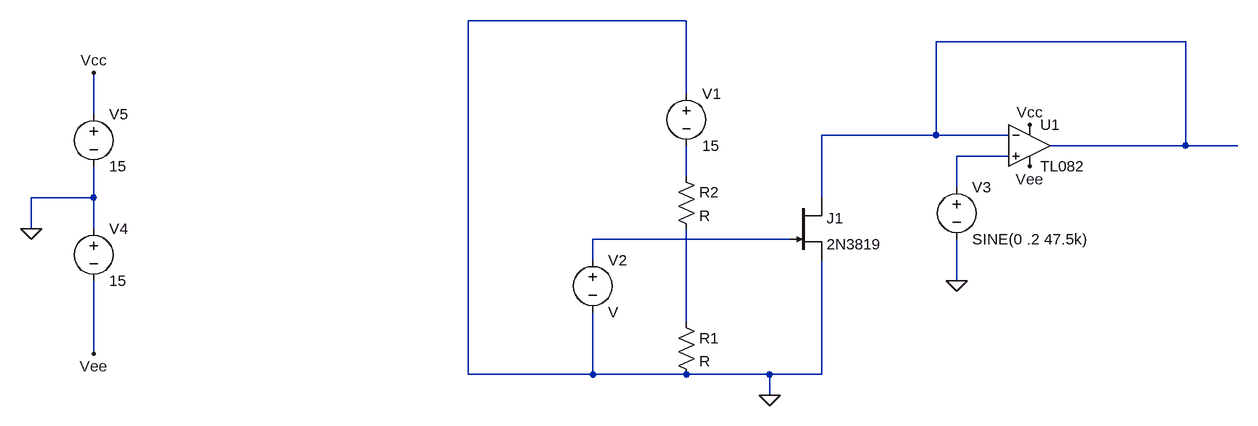
[diagram p0: schematic Modulateur.asc]
Modulateur.asc, the LTspice schematic file:
Version 4.1
SHEET 1 880 680
WIRE -32 -144 -368 -144
WIRE 736 -112 352 -112
WIRE -32 -32 -32 -144
WIRE -944 0 -944 -64
WIRE 352 32 352 -112
WIRE 352 32 176 32
WIRE 464 32 352 32
WIRE 736 48 736 -112
WIRE 736 48 528 48
WIRE 816 48 736 48
WIRE 464 64 384 64
WIRE -32 96 -32 48
WIRE 384 112 384 64
WIRE -944 128 -944 80
WIRE -944 128 -1040 128
WIRE 176 128 176 32
WIRE -1040 176 -1040 128
WIRE -944 176 -944 128
WIRE 128 192 -176 192
WIRE -176 224 -176 192
WIRE 384 256 384 192
WIRE -32 320 -32 176
WIRE -944 368 -944 256
WIRE -368 400 -368 -144
WIRE -176 400 -176 304
WIRE -176 400 -368 400
WIRE -32 400 -176 400
WIRE 96 400 -32 400
WIRE 176 400 176 224
WIRE 176 400 96 400
WIRE 96 432 96 400
FLAG 96 432 0
FLAG 384 256 0
FLAG -1040 176 0
FLAG -944 -64 Vcc
FLAG 496 16 Vcc
FLAG -944 368 Vee
FLAG 496 80 Vee
SYMBOL njf 128 128 R0
SYMATTR InstName J1
SYMATTR Value 2N3819
SYMBOL voltage -32 -48 R0
SYMATTR InstName V1
SYMATTR Value 15
SYMBOL res -48 304 R0
SYMATTR InstName R1
SYMBOL res -48 80 R0
SYMATTR InstName R2
SYMBOL voltage -176 208 R0
SYMATTR InstName V2
SYMBOL OpAmps\\opamp2 496 -16 R0
SYMATTR InstName U1
SYMATTR Value TL082
SYMBOL voltage 384 96 R0
WINDOW 123 0 0 Left 0
WINDOW 39 0 0 Left 0
SYMATTR InstName V3
SYMATTR Value SINE(0 .2 47.5k)
SYMBOL voltage -944 160 R0
WINDOW 123 0 0 Left 0
WINDOW 39 0 0 Left 0
SYMATTR InstName V4
SYMATTR Value 15
SYMBOL voltage -944 -16 R0
SYMATTR InstName V5
SYMATTR Value 15

The netlist it stands for:
* Modulateur.asc
J1 N001 N004 0 2N3819
V1 0 N003 15
R1 N005 0 R
R2 N003 N005 R
V2 N004 0 V
X§U1 N002 N001 Vcc Vee N001 TL082  ; pins In+ In- V+ V- OUT
V3 N002 0 SINE(0 .2 47.5k)
V4 0 Vee 15
V5 Vcc 0 15
.model NJF NJF
.model PJF PJF
.lib standard.jft
.backanno
.end